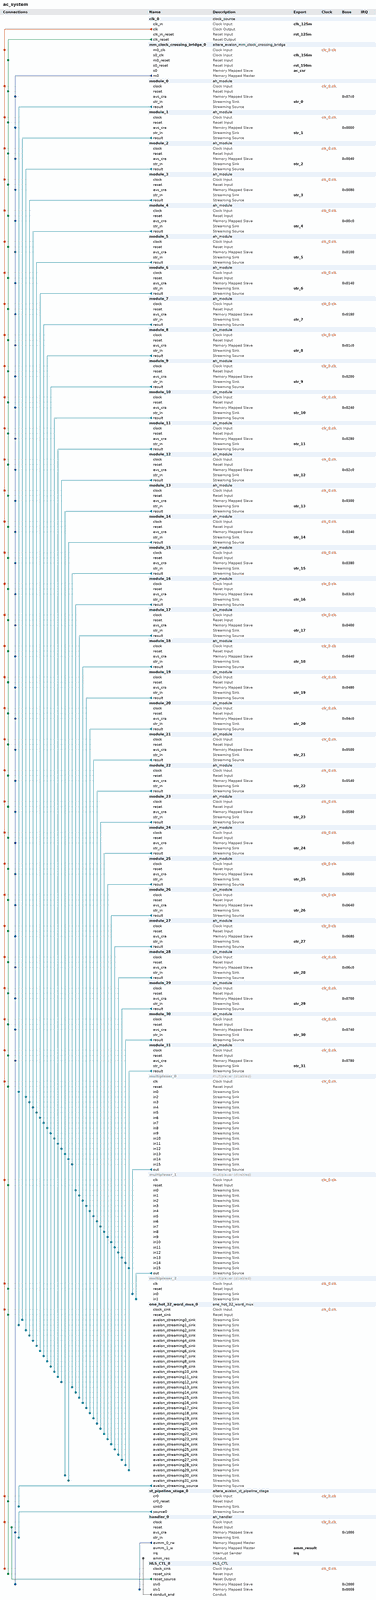
[diagram p0: system contents, whole]
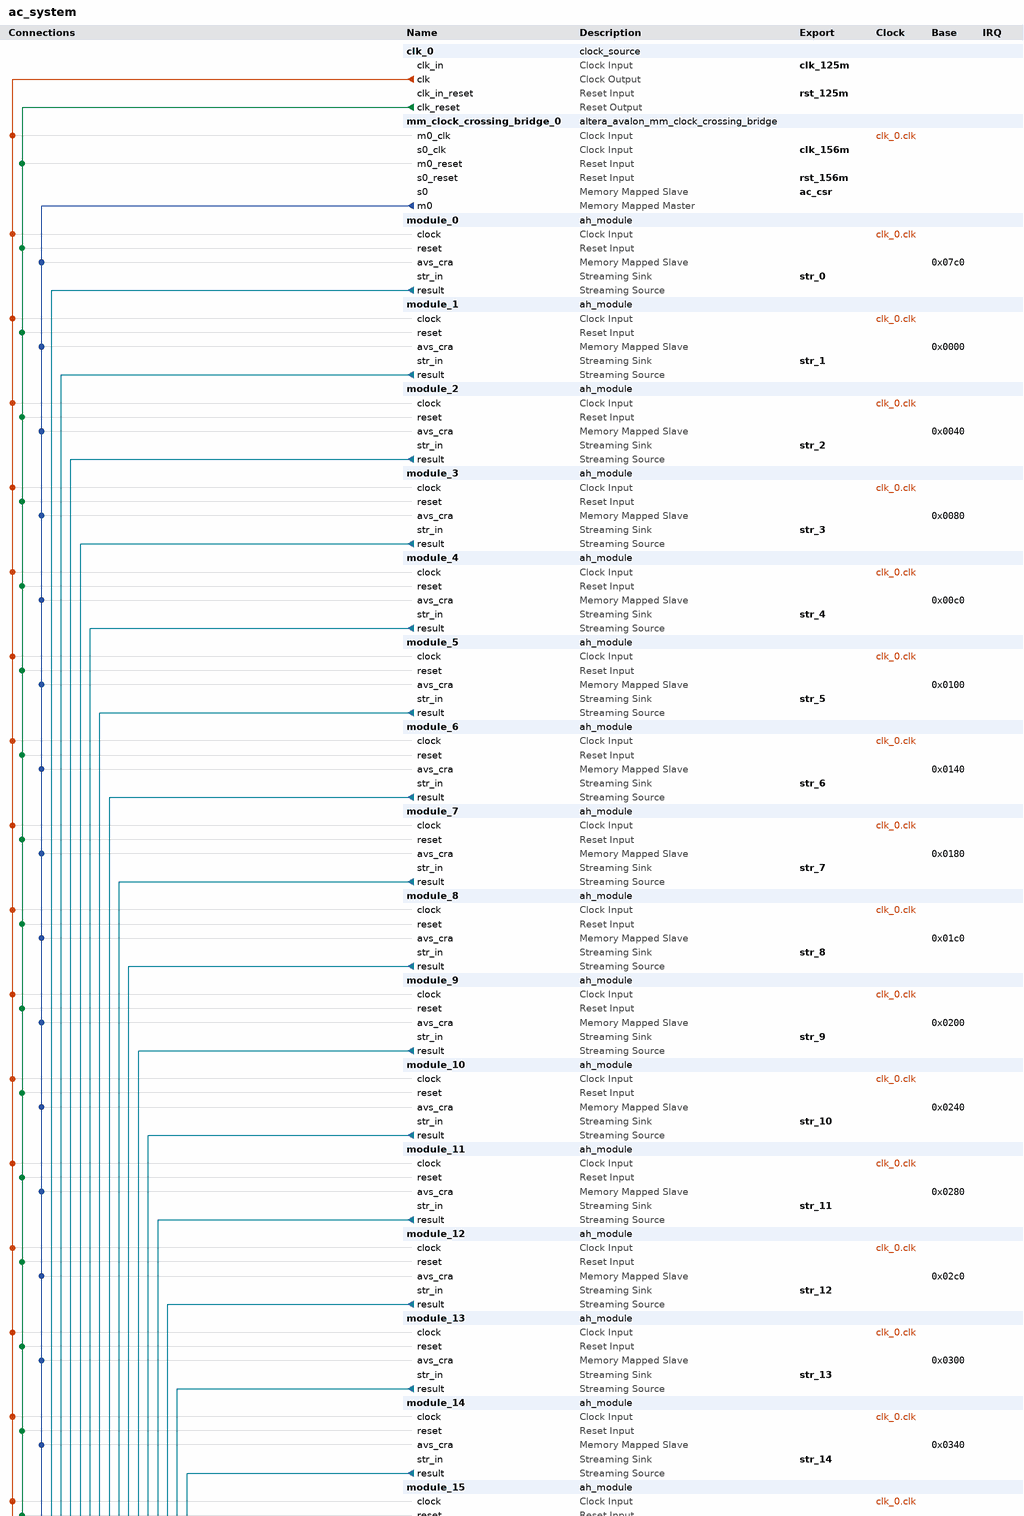
[diagram p1: system contents, upper part]
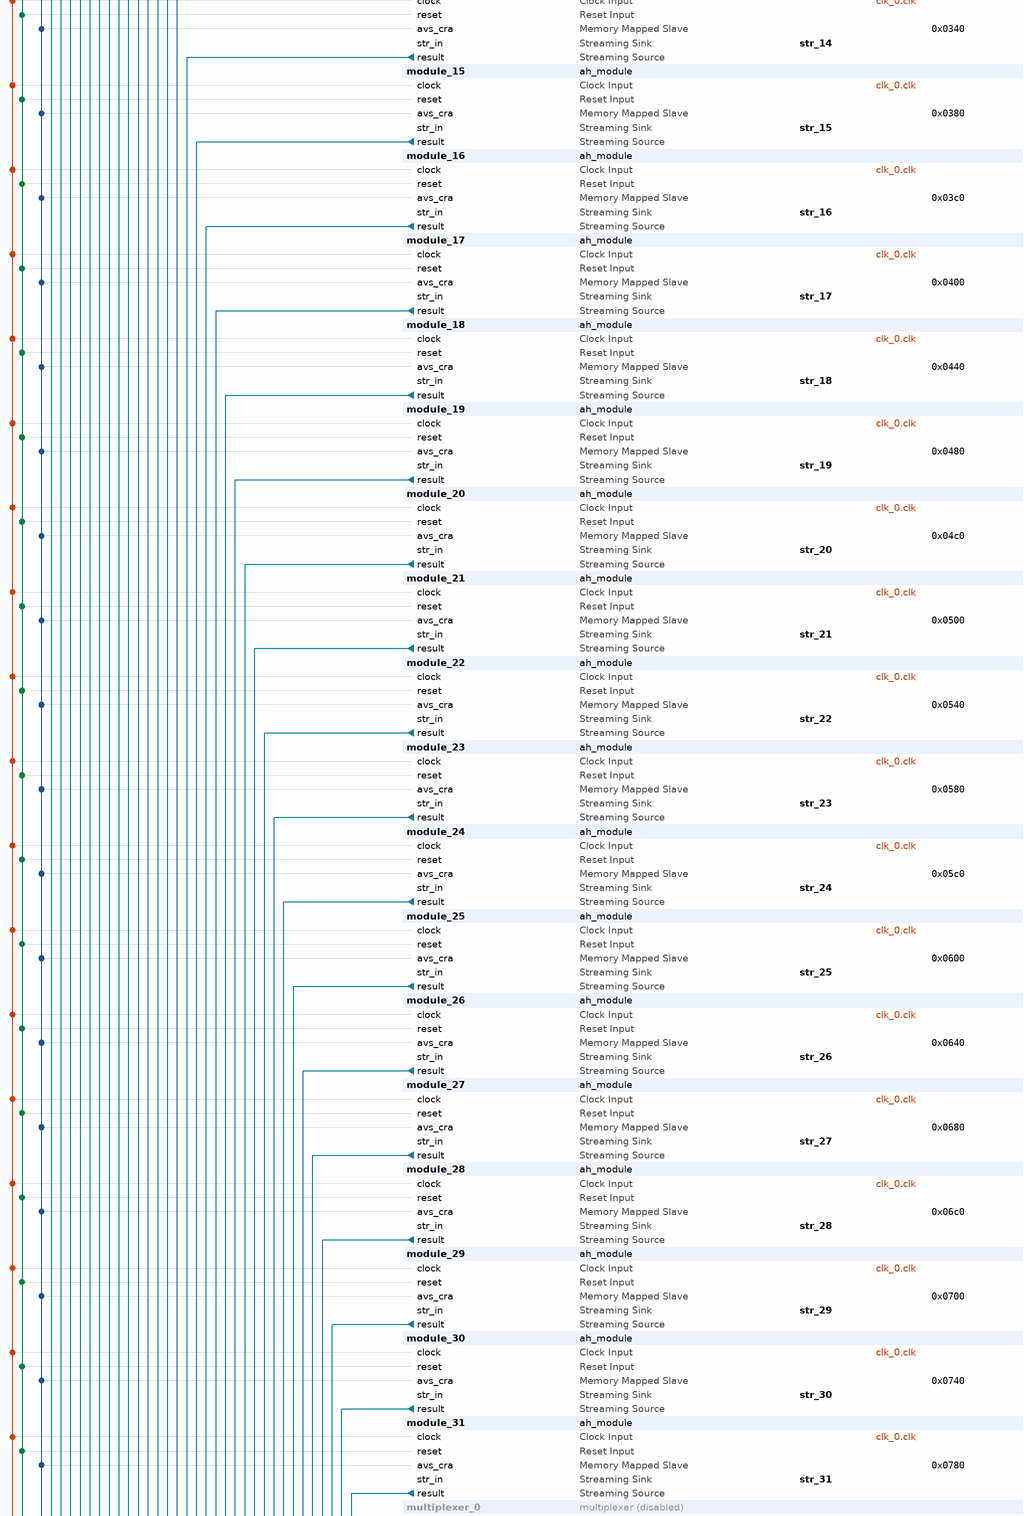
[diagram p2: system contents, middle part]
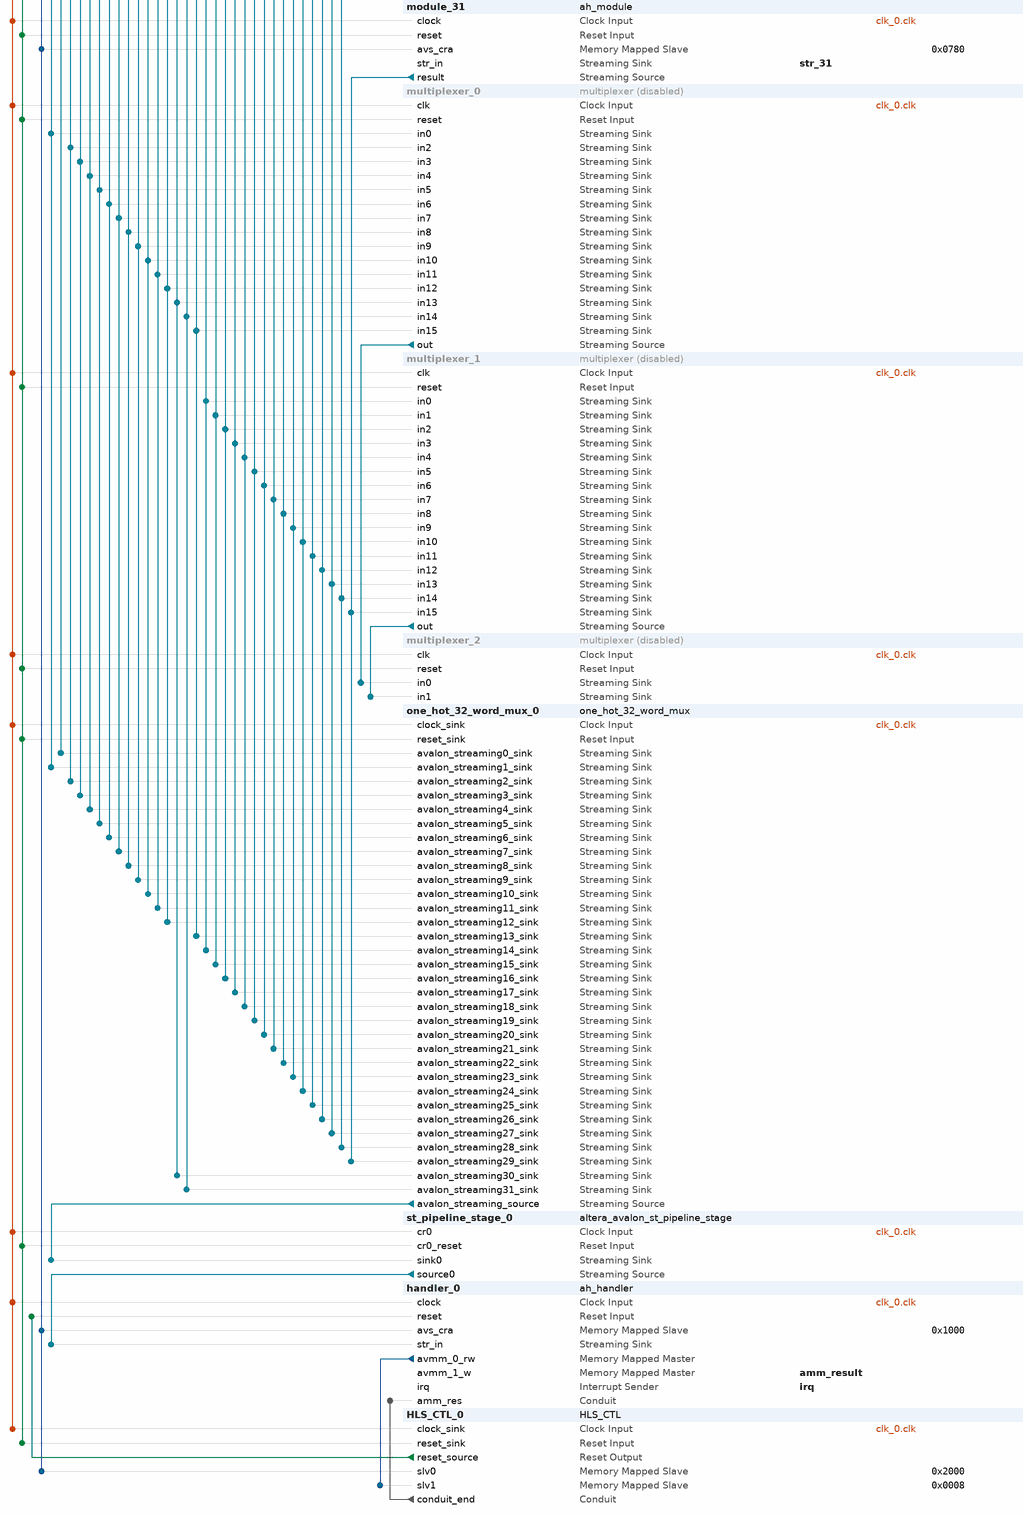
[diagram p3: system contents, lower part]
# Platform Designer (Qsys) system ac_system, Cyclone V 5CSEBA6U23I7
# Parameters at their usual value, and those the tool derives, are not listed.
package require -exact qsys 16.1
create_system ac_system
set_project_property DEVICE_FAMILY {Cyclone V}
set_project_property DEVICE 5CSEBA6U23I7

add_instance clk_0 clock_source 16.1
set_instance_parameter_value clk_0 clockFrequency 50000000

add_instance mm_clock_crossing_bridge_0 altera_avalon_mm_clock_crossing_bridge 16.1
set_instance_parameter_value mm_clock_crossing_bridge_0 ADDRESS_WIDTH 10
set_instance_parameter_value mm_clock_crossing_bridge_0 COMMAND_FIFO_DEPTH 4
set_instance_parameter_value mm_clock_crossing_bridge_0 DATA_WIDTH 64
set_instance_parameter_value mm_clock_crossing_bridge_0 MASTER_SYNC_DEPTH 2
set_instance_parameter_value mm_clock_crossing_bridge_0 MAX_BURST_SIZE 1
set_instance_parameter_value mm_clock_crossing_bridge_0 RESPONSE_FIFO_DEPTH 4
set_instance_parameter_value mm_clock_crossing_bridge_0 SLAVE_SYNC_DEPTH 2
set_instance_parameter_value mm_clock_crossing_bridge_0 USE_AUTO_ADDRESS_WIDTH 1

add_instance module_0 ah_module 1.0

add_instance module_1 ah_module 1.0

add_instance module_2 ah_module 1.0

add_instance module_3 ah_module 1.0

add_instance module_4 ah_module 1.0

add_instance module_5 ah_module 1.0

add_instance module_6 ah_module 1.0

add_instance module_7 ah_module 1.0

add_instance module_8 ah_module 1.0

add_instance module_9 ah_module 1.0

add_instance module_10 ah_module 1.0

add_instance module_11 ah_module 1.0

add_instance module_12 ah_module 1.0

add_instance module_13 ah_module 1.0

add_instance module_14 ah_module 1.0

add_instance module_15 ah_module 1.0

add_instance module_16 ah_module 1.0

add_instance module_17 ah_module 1.0

add_instance module_18 ah_module 1.0

add_instance module_19 ah_module 1.0

add_instance module_20 ah_module 1.0

add_instance module_21 ah_module 1.0

add_instance module_22 ah_module 1.0

add_instance module_23 ah_module 1.0

add_instance module_24 ah_module 1.0

add_instance module_25 ah_module 1.0

add_instance module_26 ah_module 1.0

add_instance module_27 ah_module 1.0

add_instance module_28 ah_module 1.0

add_instance module_29 ah_module 1.0

add_instance module_30 ah_module 1.0

add_instance module_31 ah_module 1.0

add_instance multiplexer_0 multiplexer 16.1
set_instance_property multiplexer_0 ENABLED false
set_instance_parameter_value multiplexer_0 bitsPerSymbol 64
set_instance_parameter_value multiplexer_0 errorWidth 0
set_instance_parameter_value multiplexer_0 numInputInterfaces 16
set_instance_parameter_value multiplexer_0 outChannelWidth 4
set_instance_parameter_value multiplexer_0 packetScheduling false
set_instance_parameter_value multiplexer_0 schedulingSize 2
set_instance_parameter_value multiplexer_0 symbolsPerBeat 1
set_instance_parameter_value multiplexer_0 useHighBitsOfChannel false
set_instance_parameter_value multiplexer_0 usePackets false

add_instance multiplexer_1 multiplexer 16.1
set_instance_property multiplexer_1 ENABLED false
set_instance_parameter_value multiplexer_1 bitsPerSymbol 64
set_instance_parameter_value multiplexer_1 errorWidth 0
set_instance_parameter_value multiplexer_1 numInputInterfaces 16
set_instance_parameter_value multiplexer_1 outChannelWidth 4
set_instance_parameter_value multiplexer_1 packetScheduling false
set_instance_parameter_value multiplexer_1 schedulingSize 2
set_instance_parameter_value multiplexer_1 symbolsPerBeat 1
set_instance_parameter_value multiplexer_1 useHighBitsOfChannel false
set_instance_parameter_value multiplexer_1 usePackets false

add_instance multiplexer_2 multiplexer 16.1
set_instance_property multiplexer_2 ENABLED false
set_instance_parameter_value multiplexer_2 bitsPerSymbol 64
set_instance_parameter_value multiplexer_2 errorWidth 0
set_instance_parameter_value multiplexer_2 numInputInterfaces 2
set_instance_parameter_value multiplexer_2 outChannelWidth 1
set_instance_parameter_value multiplexer_2 packetScheduling false
set_instance_parameter_value multiplexer_2 schedulingSize 2
set_instance_parameter_value multiplexer_2 symbolsPerBeat 1
set_instance_parameter_value multiplexer_2 useHighBitsOfChannel false
set_instance_parameter_value multiplexer_2 usePackets false

add_instance one_hot_32_word_mux_0 one_hot_32_word_mux 1.0
set_instance_parameter_value one_hot_32_word_mux_0 AST_SYMBOLS 1
set_instance_parameter_value one_hot_32_word_mux_0 BYTE_W 64

add_instance st_pipeline_stage_0 altera_avalon_st_pipeline_stage 16.1
set_instance_parameter_value st_pipeline_stage_0 BITS_PER_SYMBOL 64
set_instance_parameter_value st_pipeline_stage_0 CHANNEL_WIDTH 0
set_instance_parameter_value st_pipeline_stage_0 ERROR_WIDTH 0
set_instance_parameter_value st_pipeline_stage_0 MAX_CHANNEL 0
set_instance_parameter_value st_pipeline_stage_0 PIPELINE_READY 1
set_instance_parameter_value st_pipeline_stage_0 SYMBOLS_PER_BEAT 1
set_instance_parameter_value st_pipeline_stage_0 USE_EMPTY 0
set_instance_parameter_value st_pipeline_stage_0 USE_PACKETS 0

add_instance handler_0 ah_handler 1.0

add_instance HLS_CTL_0 HLS_CTL 1.0

# connections
add_connection clk_0.clk handler_0.clock clock
add_connection clk_0.clk HLS_CTL_0.clock_sink clock
add_connection clk_0.clk mm_clock_crossing_bridge_0.m0_clk clock
add_connection clk_0.clk module_0.clock clock
add_connection clk_0.clk module_1.clock clock
add_connection clk_0.clk module_2.clock clock
add_connection clk_0.clk module_3.clock clock
add_connection clk_0.clk module_4.clock clock
add_connection clk_0.clk module_5.clock clock
add_connection clk_0.clk module_6.clock clock
add_connection clk_0.clk module_7.clock clock
add_connection clk_0.clk module_8.clock clock
add_connection clk_0.clk module_9.clock clock
add_connection clk_0.clk module_10.clock clock
add_connection clk_0.clk module_11.clock clock
add_connection clk_0.clk module_12.clock clock
add_connection clk_0.clk module_13.clock clock
add_connection clk_0.clk module_14.clock clock
add_connection clk_0.clk module_15.clock clock
add_connection clk_0.clk module_16.clock clock
add_connection clk_0.clk module_17.clock clock
add_connection clk_0.clk module_18.clock clock
add_connection clk_0.clk module_19.clock clock
add_connection clk_0.clk module_20.clock clock
add_connection clk_0.clk module_21.clock clock
add_connection clk_0.clk module_22.clock clock
add_connection clk_0.clk module_23.clock clock
add_connection clk_0.clk module_24.clock clock
add_connection clk_0.clk module_25.clock clock
add_connection clk_0.clk module_26.clock clock
add_connection clk_0.clk module_27.clock clock
add_connection clk_0.clk module_28.clock clock
add_connection clk_0.clk module_29.clock clock
add_connection clk_0.clk module_30.clock clock
add_connection clk_0.clk module_31.clock clock
add_connection clk_0.clk multiplexer_0.clk clock
add_connection clk_0.clk multiplexer_1.clk clock
add_connection clk_0.clk multiplexer_2.clk clock
add_connection clk_0.clk one_hot_32_word_mux_0.clock_sink clock
add_connection clk_0.clk st_pipeline_stage_0.cr0 clock
add_connection clk_0.clk_reset HLS_CTL_0.reset_sink reset
add_connection clk_0.clk_reset mm_clock_crossing_bridge_0.m0_reset reset
add_connection clk_0.clk_reset module_0.reset reset
add_connection clk_0.clk_reset module_1.reset reset
add_connection clk_0.clk_reset module_2.reset reset
add_connection clk_0.clk_reset module_3.reset reset
add_connection clk_0.clk_reset module_4.reset reset
add_connection clk_0.clk_reset module_5.reset reset
add_connection clk_0.clk_reset module_6.reset reset
add_connection clk_0.clk_reset module_7.reset reset
add_connection clk_0.clk_reset module_8.reset reset
add_connection clk_0.clk_reset module_9.reset reset
add_connection clk_0.clk_reset module_10.reset reset
add_connection clk_0.clk_reset module_11.reset reset
add_connection clk_0.clk_reset module_12.reset reset
add_connection clk_0.clk_reset module_13.reset reset
add_connection clk_0.clk_reset module_14.reset reset
add_connection clk_0.clk_reset module_15.reset reset
add_connection clk_0.clk_reset module_16.reset reset
add_connection clk_0.clk_reset module_17.reset reset
add_connection clk_0.clk_reset module_18.reset reset
add_connection clk_0.clk_reset module_19.reset reset
add_connection clk_0.clk_reset module_20.reset reset
add_connection clk_0.clk_reset module_21.reset reset
add_connection clk_0.clk_reset module_22.reset reset
add_connection clk_0.clk_reset module_23.reset reset
add_connection clk_0.clk_reset module_24.reset reset
add_connection clk_0.clk_reset module_25.reset reset
add_connection clk_0.clk_reset module_26.reset reset
add_connection clk_0.clk_reset module_27.reset reset
add_connection clk_0.clk_reset module_28.reset reset
add_connection clk_0.clk_reset module_29.reset reset
add_connection clk_0.clk_reset module_30.reset reset
add_connection clk_0.clk_reset module_31.reset reset
add_connection clk_0.clk_reset multiplexer_0.reset reset
add_connection clk_0.clk_reset multiplexer_1.reset reset
add_connection clk_0.clk_reset multiplexer_2.reset reset
add_connection clk_0.clk_reset one_hot_32_word_mux_0.reset_sink reset
add_connection clk_0.clk_reset st_pipeline_stage_0.cr0_reset reset
add_connection HLS_CTL_0.reset_source handler_0.reset reset
add_connection handler_0.avmm_0_rw HLS_CTL_0.slv1 avalon
set_connection_parameter_value handler_0.avmm_0_rw/HLS_CTL_0.slv1 baseAddress 0x0008
add_connection mm_clock_crossing_bridge_0.m0 handler_0.avs_cra avalon
set_connection_parameter_value mm_clock_crossing_bridge_0.m0/handler_0.avs_cra baseAddress 0x1000
add_connection mm_clock_crossing_bridge_0.m0 HLS_CTL_0.slv0 avalon
set_connection_parameter_value mm_clock_crossing_bridge_0.m0/HLS_CTL_0.slv0 baseAddress 0x2000
add_connection mm_clock_crossing_bridge_0.m0 module_0.avs_cra avalon
set_connection_parameter_value mm_clock_crossing_bridge_0.m0/module_0.avs_cra baseAddress 0x07c0
add_connection mm_clock_crossing_bridge_0.m0 module_1.avs_cra avalon
set_connection_parameter_value mm_clock_crossing_bridge_0.m0/module_1.avs_cra baseAddress 0x0000
add_connection mm_clock_crossing_bridge_0.m0 module_2.avs_cra avalon
set_connection_parameter_value mm_clock_crossing_bridge_0.m0/module_2.avs_cra baseAddress 0x0040
add_connection mm_clock_crossing_bridge_0.m0 module_3.avs_cra avalon
set_connection_parameter_value mm_clock_crossing_bridge_0.m0/module_3.avs_cra baseAddress 0x0080
add_connection mm_clock_crossing_bridge_0.m0 module_4.avs_cra avalon
set_connection_parameter_value mm_clock_crossing_bridge_0.m0/module_4.avs_cra baseAddress 0x00c0
add_connection mm_clock_crossing_bridge_0.m0 module_5.avs_cra avalon
set_connection_parameter_value mm_clock_crossing_bridge_0.m0/module_5.avs_cra baseAddress 0x0100
add_connection mm_clock_crossing_bridge_0.m0 module_6.avs_cra avalon
set_connection_parameter_value mm_clock_crossing_bridge_0.m0/module_6.avs_cra baseAddress 0x0140
add_connection mm_clock_crossing_bridge_0.m0 module_7.avs_cra avalon
set_connection_parameter_value mm_clock_crossing_bridge_0.m0/module_7.avs_cra baseAddress 0x0180
add_connection mm_clock_crossing_bridge_0.m0 module_8.avs_cra avalon
set_connection_parameter_value mm_clock_crossing_bridge_0.m0/module_8.avs_cra baseAddress 0x01c0
add_connection mm_clock_crossing_bridge_0.m0 module_9.avs_cra avalon
set_connection_parameter_value mm_clock_crossing_bridge_0.m0/module_9.avs_cra baseAddress 0x0200
add_connection mm_clock_crossing_bridge_0.m0 module_10.avs_cra avalon
set_connection_parameter_value mm_clock_crossing_bridge_0.m0/module_10.avs_cra baseAddress 0x0240
add_connection mm_clock_crossing_bridge_0.m0 module_11.avs_cra avalon
set_connection_parameter_value mm_clock_crossing_bridge_0.m0/module_11.avs_cra baseAddress 0x0280
add_connection mm_clock_crossing_bridge_0.m0 module_12.avs_cra avalon
set_connection_parameter_value mm_clock_crossing_bridge_0.m0/module_12.avs_cra baseAddress 0x02c0
add_connection mm_clock_crossing_bridge_0.m0 module_13.avs_cra avalon
set_connection_parameter_value mm_clock_crossing_bridge_0.m0/module_13.avs_cra baseAddress 0x0300
add_connection mm_clock_crossing_bridge_0.m0 module_14.avs_cra avalon
set_connection_parameter_value mm_clock_crossing_bridge_0.m0/module_14.avs_cra baseAddress 0x0340
add_connection mm_clock_crossing_bridge_0.m0 module_15.avs_cra avalon
set_connection_parameter_value mm_clock_crossing_bridge_0.m0/module_15.avs_cra baseAddress 0x0380
add_connection mm_clock_crossing_bridge_0.m0 module_16.avs_cra avalon
set_connection_parameter_value mm_clock_crossing_bridge_0.m0/module_16.avs_cra baseAddress 0x03c0
add_connection mm_clock_crossing_bridge_0.m0 module_17.avs_cra avalon
set_connection_parameter_value mm_clock_crossing_bridge_0.m0/module_17.avs_cra baseAddress 0x0400
add_connection mm_clock_crossing_bridge_0.m0 module_18.avs_cra avalon
set_connection_parameter_value mm_clock_crossing_bridge_0.m0/module_18.avs_cra baseAddress 0x0440
add_connection mm_clock_crossing_bridge_0.m0 module_19.avs_cra avalon
set_connection_parameter_value mm_clock_crossing_bridge_0.m0/module_19.avs_cra baseAddress 0x0480
add_connection mm_clock_crossing_bridge_0.m0 module_20.avs_cra avalon
set_connection_parameter_value mm_clock_crossing_bridge_0.m0/module_20.avs_cra baseAddress 0x04c0
add_connection mm_clock_crossing_bridge_0.m0 module_21.avs_cra avalon
set_connection_parameter_value mm_clock_crossing_bridge_0.m0/module_21.avs_cra baseAddress 0x0500
add_connection mm_clock_crossing_bridge_0.m0 module_22.avs_cra avalon
set_connection_parameter_value mm_clock_crossing_bridge_0.m0/module_22.avs_cra baseAddress 0x0540
add_connection mm_clock_crossing_bridge_0.m0 module_23.avs_cra avalon
set_connection_parameter_value mm_clock_crossing_bridge_0.m0/module_23.avs_cra baseAddress 0x0580
add_connection mm_clock_crossing_bridge_0.m0 module_24.avs_cra avalon
set_connection_parameter_value mm_clock_crossing_bridge_0.m0/module_24.avs_cra baseAddress 0x05c0
add_connection mm_clock_crossing_bridge_0.m0 module_25.avs_cra avalon
set_connection_parameter_value mm_clock_crossing_bridge_0.m0/module_25.avs_cra baseAddress 0x0600
add_connection mm_clock_crossing_bridge_0.m0 module_26.avs_cra avalon
set_connection_parameter_value mm_clock_crossing_bridge_0.m0/module_26.avs_cra baseAddress 0x0640
add_connection mm_clock_crossing_bridge_0.m0 module_27.avs_cra avalon
set_connection_parameter_value mm_clock_crossing_bridge_0.m0/module_27.avs_cra baseAddress 0x0680
add_connection mm_clock_crossing_bridge_0.m0 module_28.avs_cra avalon
set_connection_parameter_value mm_clock_crossing_bridge_0.m0/module_28.avs_cra baseAddress 0x06c0
add_connection mm_clock_crossing_bridge_0.m0 module_29.avs_cra avalon
set_connection_parameter_value mm_clock_crossing_bridge_0.m0/module_29.avs_cra baseAddress 0x0700
add_connection mm_clock_crossing_bridge_0.m0 module_30.avs_cra avalon
set_connection_parameter_value mm_clock_crossing_bridge_0.m0/module_30.avs_cra baseAddress 0x0740
add_connection mm_clock_crossing_bridge_0.m0 module_31.avs_cra avalon
set_connection_parameter_value mm_clock_crossing_bridge_0.m0/module_31.avs_cra baseAddress 0x0780
add_connection module_0.result multiplexer_0.in0 avalon_streaming
add_connection module_0.result one_hot_32_word_mux_0.avalon_streaming1_sink avalon_streaming
add_connection module_1.result one_hot_32_word_mux_0.avalon_streaming0_sink avalon_streaming
add_connection module_2.result multiplexer_0.in2 avalon_streaming
add_connection module_2.result one_hot_32_word_mux_0.avalon_streaming2_sink avalon_streaming
add_connection module_3.result multiplexer_0.in3 avalon_streaming
add_connection module_3.result one_hot_32_word_mux_0.avalon_streaming3_sink avalon_streaming
add_connection module_4.result multiplexer_0.in4 avalon_streaming
add_connection module_4.result one_hot_32_word_mux_0.avalon_streaming4_sink avalon_streaming
add_connection module_5.result multiplexer_0.in5 avalon_streaming
add_connection module_5.result one_hot_32_word_mux_0.avalon_streaming5_sink avalon_streaming
add_connection module_6.result multiplexer_0.in6 avalon_streaming
add_connection module_6.result one_hot_32_word_mux_0.avalon_streaming6_sink avalon_streaming
add_connection module_7.result multiplexer_0.in7 avalon_streaming
add_connection module_7.result one_hot_32_word_mux_0.avalon_streaming7_sink avalon_streaming
add_connection module_8.result multiplexer_0.in8 avalon_streaming
add_connection module_8.result one_hot_32_word_mux_0.avalon_streaming8_sink avalon_streaming
add_connection module_9.result multiplexer_0.in9 avalon_streaming
add_connection module_9.result one_hot_32_word_mux_0.avalon_streaming9_sink avalon_streaming
add_connection module_10.result multiplexer_0.in10 avalon_streaming
add_connection module_10.result one_hot_32_word_mux_0.avalon_streaming10_sink avalon_streaming
add_connection module_11.result multiplexer_0.in11 avalon_streaming
add_connection module_11.result one_hot_32_word_mux_0.avalon_streaming11_sink avalon_streaming
add_connection module_12.result multiplexer_0.in12 avalon_streaming
add_connection module_12.result one_hot_32_word_mux_0.avalon_streaming12_sink avalon_streaming
add_connection module_13.result multiplexer_0.in13 avalon_streaming
add_connection module_13.result one_hot_32_word_mux_0.avalon_streaming30_sink avalon_streaming
add_connection module_14.result multiplexer_0.in14 avalon_streaming
add_connection module_14.result one_hot_32_word_mux_0.avalon_streaming31_sink avalon_streaming
add_connection module_15.result multiplexer_0.in15 avalon_streaming
add_connection module_15.result one_hot_32_word_mux_0.avalon_streaming13_sink avalon_streaming
add_connection module_16.result multiplexer_1.in0 avalon_streaming
add_connection module_16.result one_hot_32_word_mux_0.avalon_streaming14_sink avalon_streaming
add_connection module_17.result multiplexer_1.in1 avalon_streaming
add_connection module_17.result one_hot_32_word_mux_0.avalon_streaming15_sink avalon_streaming
add_connection module_18.result multiplexer_1.in2 avalon_streaming
add_connection module_18.result one_hot_32_word_mux_0.avalon_streaming16_sink avalon_streaming
add_connection module_19.result multiplexer_1.in3 avalon_streaming
add_connection module_19.result one_hot_32_word_mux_0.avalon_streaming17_sink avalon_streaming
add_connection module_20.result multiplexer_1.in4 avalon_streaming
add_connection module_20.result one_hot_32_word_mux_0.avalon_streaming18_sink avalon_streaming
add_connection module_21.result multiplexer_1.in5 avalon_streaming
add_connection module_21.result one_hot_32_word_mux_0.avalon_streaming19_sink avalon_streaming
add_connection module_22.result multiplexer_1.in6 avalon_streaming
add_connection module_22.result one_hot_32_word_mux_0.avalon_streaming20_sink avalon_streaming
add_connection module_23.result multiplexer_1.in7 avalon_streaming
add_connection module_23.result one_hot_32_word_mux_0.avalon_streaming21_sink avalon_streaming
add_connection module_24.result multiplexer_1.in8 avalon_streaming
add_connection module_24.result one_hot_32_word_mux_0.avalon_streaming22_sink avalon_streaming
add_connection module_25.result multiplexer_1.in9 avalon_streaming
add_connection module_25.result one_hot_32_word_mux_0.avalon_streaming23_sink avalon_streaming
add_connection module_26.result multiplexer_1.in10 avalon_streaming
add_connection module_26.result one_hot_32_word_mux_0.avalon_streaming24_sink avalon_streaming
add_connection module_27.result multiplexer_1.in11 avalon_streaming
add_connection module_27.result one_hot_32_word_mux_0.avalon_streaming25_sink avalon_streaming
add_connection module_28.result multiplexer_1.in12 avalon_streaming
add_connection module_28.result one_hot_32_word_mux_0.avalon_streaming26_sink avalon_streaming
add_connection module_29.result multiplexer_1.in13 avalon_streaming
add_connection module_29.result one_hot_32_word_mux_0.avalon_streaming27_sink avalon_streaming
add_connection module_30.result multiplexer_1.in14 avalon_streaming
add_connection module_30.result one_hot_32_word_mux_0.avalon_streaming28_sink avalon_streaming
add_connection module_31.result multiplexer_1.in15 avalon_streaming
add_connection module_31.result one_hot_32_word_mux_0.avalon_streaming29_sink avalon_streaming
add_connection multiplexer_0.out multiplexer_2.in0 avalon_streaming
add_connection multiplexer_1.out multiplexer_2.in1 avalon_streaming
add_connection one_hot_32_word_mux_0.avalon_streaming_source st_pipeline_stage_0.sink0 avalon_streaming
add_connection st_pipeline_stage_0.source0 handler_0.str_in avalon_streaming
add_connection HLS_CTL_0.conduit_end handler_0.amm_res conduit

# exported interfaces
add_interface ac_csr avalon slave
set_interface_property ac_csr EXPORT_OF mm_clock_crossing_bridge_0.s0
add_interface amm_result avalon master
set_interface_property amm_result EXPORT_OF handler_0.avmm_1_w
add_interface clk_125m clock sink
set_interface_property clk_125m EXPORT_OF clk_0.clk_in
add_interface clk_156m clock sink
set_interface_property clk_156m EXPORT_OF mm_clock_crossing_bridge_0.s0_clk
add_interface irq interrupt sender
set_interface_property irq EXPORT_OF handler_0.irq
add_interface rst_125m reset sink
set_interface_property rst_125m EXPORT_OF clk_0.clk_in_reset
add_interface rst_156m reset sink
set_interface_property rst_156m EXPORT_OF mm_clock_crossing_bridge_0.s0_reset
add_interface str_0 avalon_streaming sink
set_interface_property str_0 EXPORT_OF module_0.str_in
add_interface str_1 avalon_streaming sink
set_interface_property str_1 EXPORT_OF module_1.str_in
add_interface str_10 avalon_streaming sink
set_interface_property str_10 EXPORT_OF module_10.str_in
add_interface str_11 avalon_streaming sink
set_interface_property str_11 EXPORT_OF module_11.str_in
add_interface str_12 avalon_streaming sink
set_interface_property str_12 EXPORT_OF module_12.str_in
add_interface str_13 avalon_streaming sink
set_interface_property str_13 EXPORT_OF module_13.str_in
add_interface str_14 avalon_streaming sink
set_interface_property str_14 EXPORT_OF module_14.str_in
add_interface str_15 avalon_streaming sink
set_interface_property str_15 EXPORT_OF module_15.str_in
add_interface str_16 avalon_streaming sink
set_interface_property str_16 EXPORT_OF module_16.str_in
add_interface str_17 avalon_streaming sink
set_interface_property str_17 EXPORT_OF module_17.str_in
add_interface str_18 avalon_streaming sink
set_interface_property str_18 EXPORT_OF module_18.str_in
add_interface str_19 avalon_streaming sink
set_interface_property str_19 EXPORT_OF module_19.str_in
add_interface str_2 avalon_streaming sink
set_interface_property str_2 EXPORT_OF module_2.str_in
add_interface str_20 avalon_streaming sink
set_interface_property str_20 EXPORT_OF module_20.str_in
add_interface str_21 avalon_streaming sink
set_interface_property str_21 EXPORT_OF module_21.str_in
add_interface str_22 avalon_streaming sink
set_interface_property str_22 EXPORT_OF module_22.str_in
add_interface str_23 avalon_streaming sink
set_interface_property str_23 EXPORT_OF module_23.str_in
add_interface str_24 avalon_streaming sink
set_interface_property str_24 EXPORT_OF module_24.str_in
add_interface str_25 avalon_streaming sink
set_interface_property str_25 EXPORT_OF module_25.str_in
add_interface str_26 avalon_streaming sink
set_interface_property str_26 EXPORT_OF module_26.str_in
add_interface str_27 avalon_streaming sink
set_interface_property str_27 EXPORT_OF module_27.str_in
add_interface str_28 avalon_streaming sink
set_interface_property str_28 EXPORT_OF module_28.str_in
add_interface str_29 avalon_streaming sink
set_interface_property str_29 EXPORT_OF module_29.str_in
add_interface str_3 avalon_streaming sink
set_interface_property str_3 EXPORT_OF module_3.str_in
add_interface str_30 avalon_streaming sink
set_interface_property str_30 EXPORT_OF module_30.str_in
add_interface str_31 avalon_streaming sink
set_interface_property str_31 EXPORT_OF module_31.str_in
add_interface str_4 avalon_streaming sink
set_interface_property str_4 EXPORT_OF module_4.str_in
add_interface str_5 avalon_streaming sink
set_interface_property str_5 EXPORT_OF module_5.str_in
add_interface str_6 avalon_streaming sink
set_interface_property str_6 EXPORT_OF module_6.str_in
add_interface str_7 avalon_streaming sink
set_interface_property str_7 EXPORT_OF module_7.str_in
add_interface str_8 avalon_streaming sink
set_interface_property str_8 EXPORT_OF module_8.str_in
add_interface str_9 avalon_streaming sink
set_interface_property str_9 EXPORT_OF module_9.str_in

set_interconnect_requirement {$system} qsys_mm.clockCrossingAdapter HANDSHAKE
set_interconnect_requirement {$system} qsys_mm.enableEccProtection FALSE
set_interconnect_requirement {$system} qsys_mm.insertDefaultSlave FALSE
set_interconnect_requirement {$system} qsys_mm.maxAdditionalLatency 1

save_system ac_system.qsys
